# Altium schematic sheet main.SchDoc
size A2
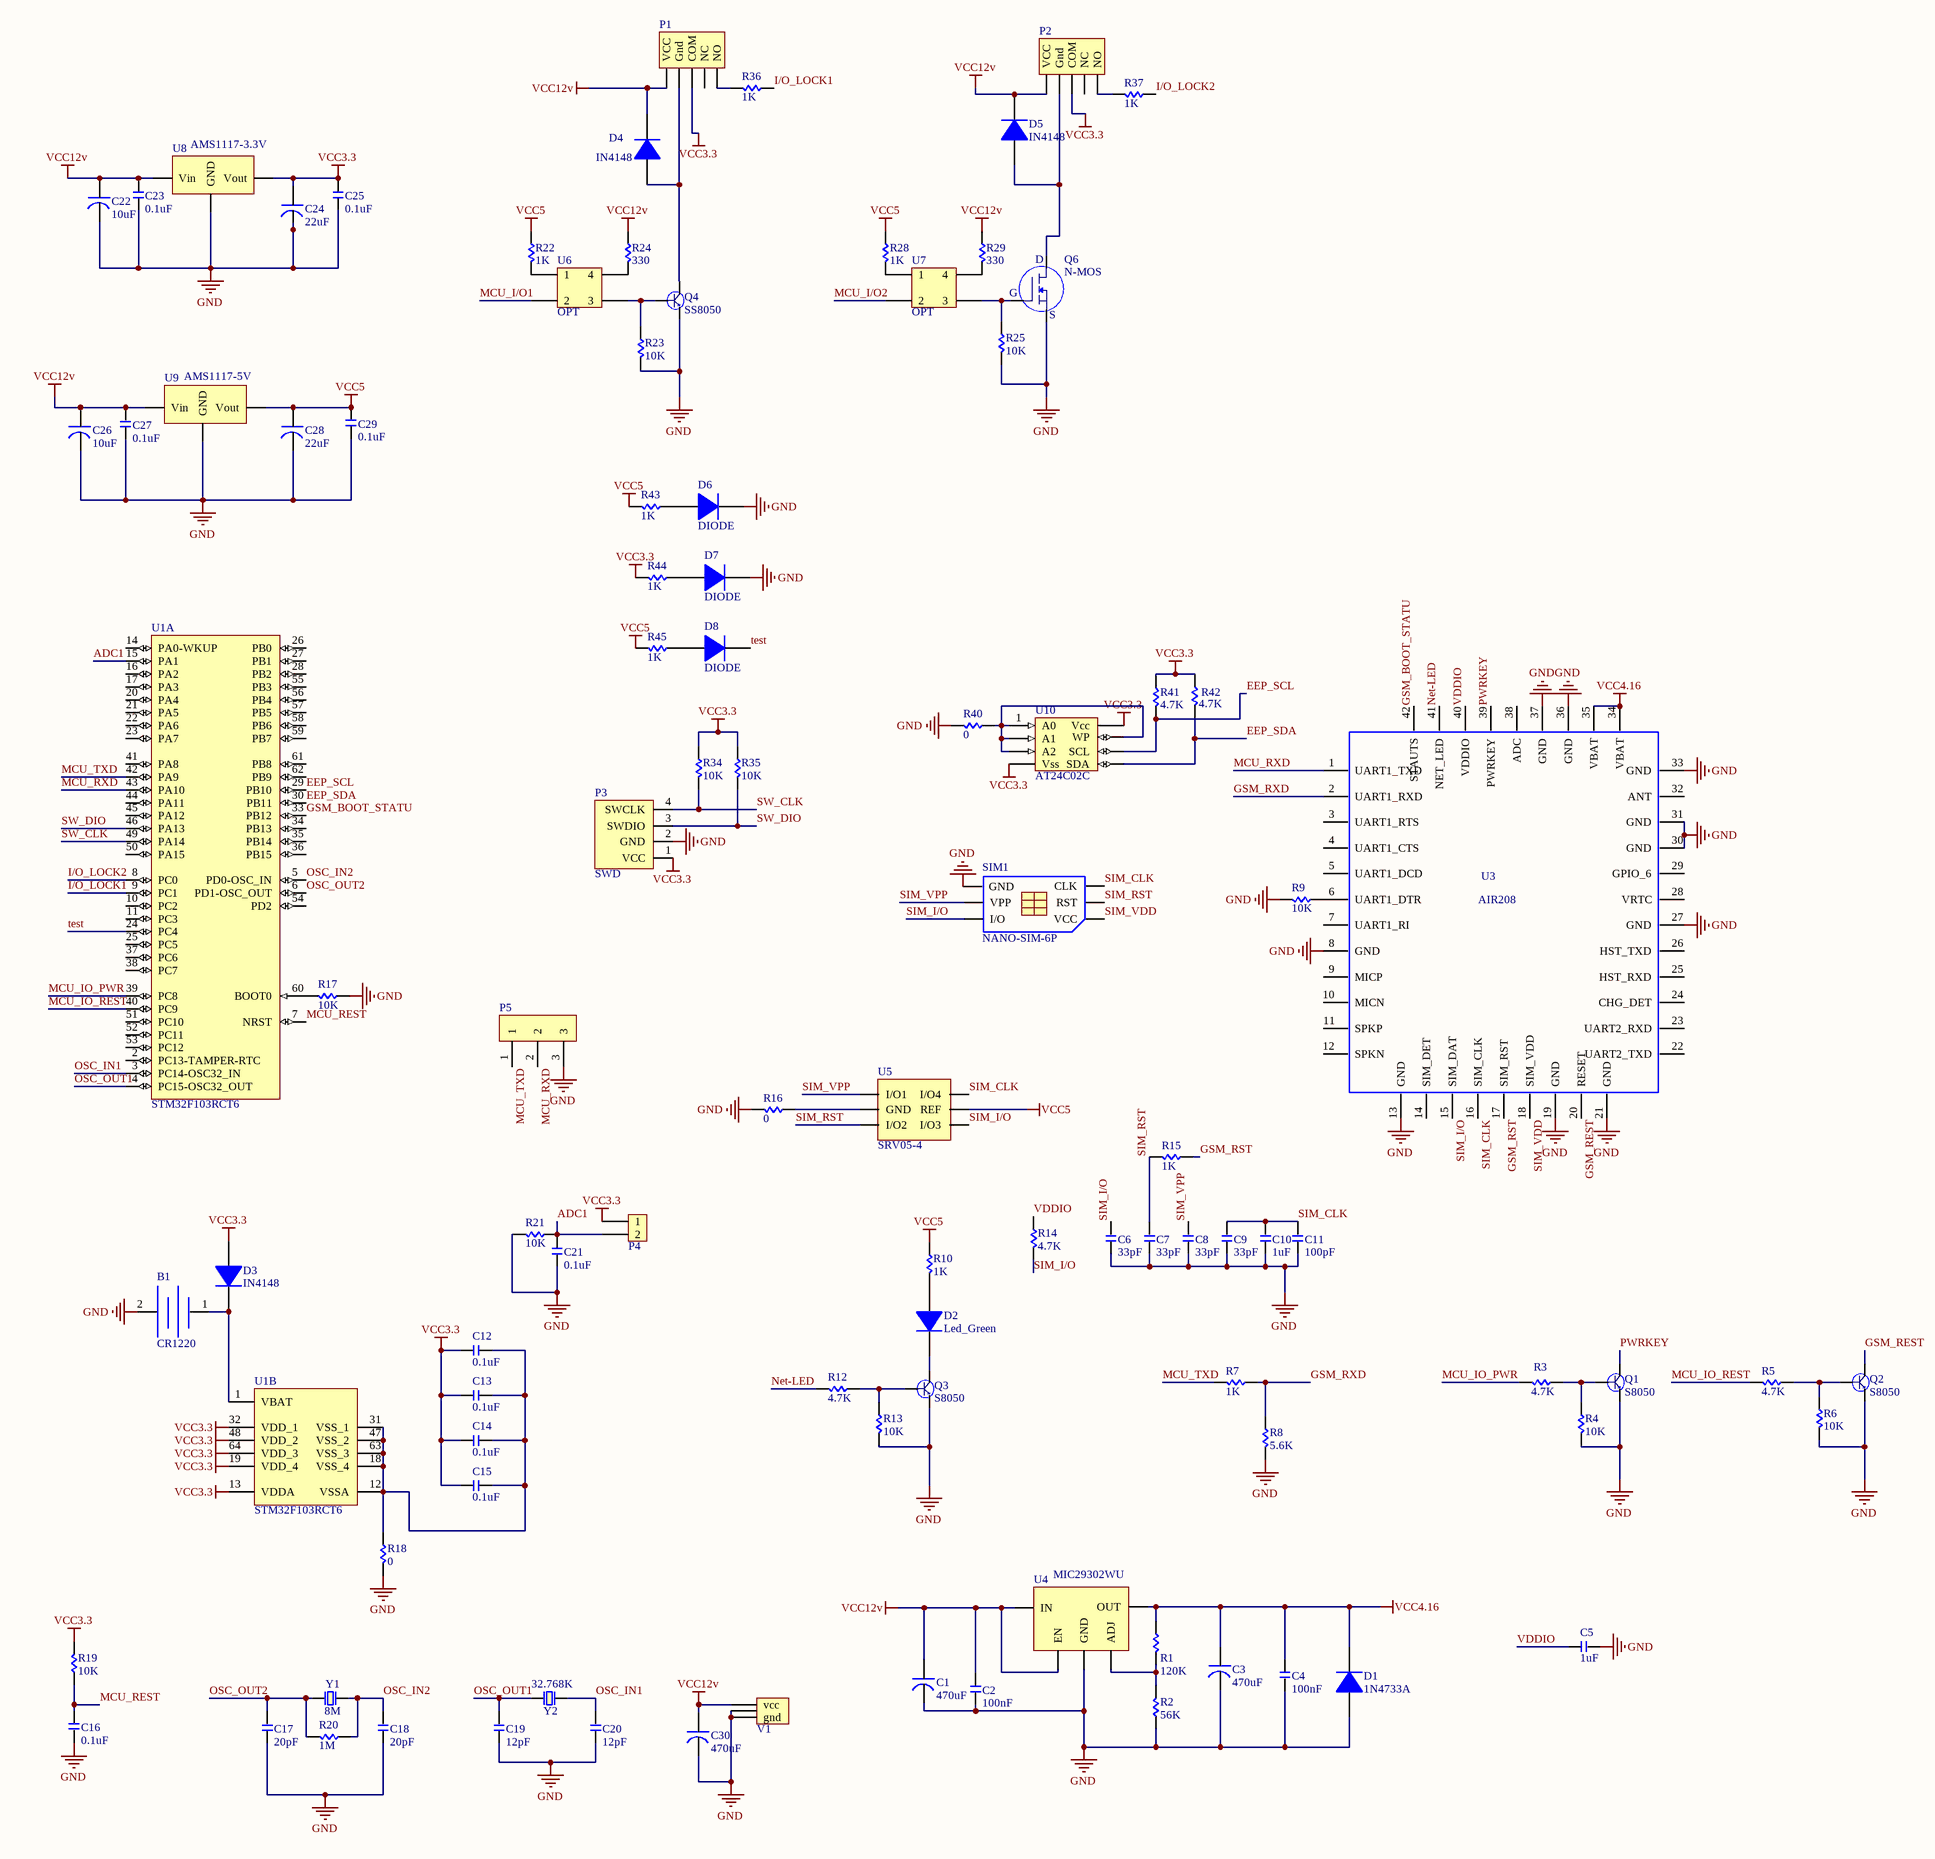
[diagram p0: main.SchDoc]

## Parts
B1  CR1220  [CR1220]
C1  470uF  [10mmx10mm+]
C2  100nF  [0805]
C3  470uF  [10mmx10mm+]
C4  100nF  [0805]
C5  1uF  [0805]
C6  33pF  [0805]
C7  33pF  [0805]
C8  33pF  [0805]
C9  33pF  [0805]
C10  1uF  [0805]
C11  100pF  [0805]
C12  0.1uF  [0805]
C13  0.1uF  [0805]
C14  0.1uF  [0805]
C15  0.1uF  [0805]
C16  0.1uF  [0805]
C17  20pF  [0805]
C18  20pF  [0805]
C19  12pF  [0805]
C20  12pF  [0805]
C21  0.1uF  [0805]
C22  10uF  [1206]
C23  0.1uF  [0805]
C24  22uF  [1206]
C25  0.1uF  [0805]
C26  10uF  [1206]
C27  0.1uF  [0805]
C28  22uF  [1206]
C29  0.1uF  [0805]
C30  470uF  [DIP2_8.3x3.1]
D1  1N4733A  [Dip-6mm]
D2  Led_Green  [0603]
D3  IN4148  [1206]
D4  IN4148  [1206]
D5  IN4148  [1206]
D6  DIODE  [0603]
D7  DIODE  [0603]
D8  DIODE  [0603]
P1  Ele_lock_Pin  [Pin5]  (value not drawn)
P2  Ele_lock_Pin  [Pin5]  (value not drawn)
P3  SWD  [PIN4]
P4  Pin2  [XH2.54_2]  (value not drawn)
P5  pin3  [PIN3]  (value not drawn)
Q1  S8050  [sot-23]
Q2  S8050  [sot-23]
Q3  S8050  [sot-23]
Q4  SS8050  [sot-23]
Q6  N-MOS  [SOT-23-3]
R1  120K  [0805]
R2  56K  [0805]
R3  4.7K  [0805]
R4  10K  [0805]
R5  4.7K  [0805]
R6  10K  [0805]
R7  1K  [0805]
R8  5.6K  [0805]
R9  10K  [0805]
R10  1K  [0805]
R12  4.7K  [0805]
R13  10K  [0805]
R14  4.7K  [0805]
R15  1K  [0805]
R16  0  [0603]
R17  10K  [0805]
R18  0  [0603]
R19  10K  [0805]
R20  1M  [0805]
R21  10K  [0805]
R22  1K  [0805]
R23  10K  [0805]
R24  330  [0805]
R25  10K  [0805]
R28  1K  [0805]
R29  330  [0805]
R34  10K  [0805]
R35  10K  [0805]
R36  1K  [0805]
R37  1K  [0805]
R40  0  [0603]
R41  4.7K  [0603]
R42  4.7K  [0603]
R43  1K  [0603]
R44  1K  [0603]
R45  1K  [0603]
SIM1  NANO-SIM-6P  [NANO-SIM-6P]
U1  STM32F103RCT6  [STM-LQFP64_M]  (parts A,B of 2)
U3  AIR208  [Air208]
U4  MIC29302WU  [TO-263-5]
U5  SRV05-4  [Sot-23-6]
U6  OPT  [SOP4]
U7  OPT  [SOP4]
U8  AMS1117-3.3V  [SOT-223]
U9  AMS1117-5V  [SOT-223]
U10  AT24C02C  [SOP8]
V1  POWER_PIN  [POWER_PIN_PCB]  (value not drawn)
Y1  8M  [crystal]
Y2  32.768K  [PIN1.1]

## Nets
GND: B1.2 C1.2 C2.1 C3.2 C4.2 C5.2 C6.1 C7.1 C8.1 C9.1 C10.1 C11.1 C16.2 C17.1 C18.1 C19.1 C20.1 C21.1 C22.2 C23.1 C24.2 C25.1 C26.2 C27.1 C28.2 C29.2 C30.2 D1.1 D6.2 D7.2 P3.2(GND) P5.3 Q1.2 Q2.2 Q3.2 Q4.2 Q6.2(S) R2.2 R4.1 R6.1 R8.1 R9.1 R13.1 R16.1 R17.2 R18.1 R21.1 R23.1 R25.1 R40.1 SIM1.5(GND) U3.8(GND) U3.13(GND) U3.19(GND) U3.21(GND) U3.27(GND) U3.30(GND) U3.31(GND) U3.33(GND) U3.36(GND) U3.37(GND) U4.3(GND) U8.1(GND) U9.1(GND) V1.2(gnd) V1.3
VCC3.3: C12.1 C13.1 C14.1 C15.1 C24.1 C25.2 D3.1 P1.3(COM) P2.3(COM) P3.1(VCC) P4.1 R19.1 R34.2 R35.2 R41.2 R42.2 R44.1 U1.13(VDDA) U1.19(VDD_4) U1.32(VDD_1) U1.48(VDD_2) U1.64(VDD_3) U8.2(Vout) U10.4(Vss) U10.8(Vcc)
VCC4.16: C3.1 C4.1 D1.2 R1.2 U3.34(VBAT) U3.35(VBAT) U4.4(OUT)
VCC5: C28.1 C29.1 R10.2 R22.2 R28.2 R43.1 R45.1 U5.5(REF) U9.2(Vout)
VCC12v: C1.1 C2.2 C22.1 C23.2 C26.1 C27.2 C30.1 D4.2 D5.2 P1.1(VCC) P2.1(VCC) R24.2 R29.2 U4.1(EN) U4.2(IN) U8.3(Vin) U9.3(Vin) V1.1(vcc)
ADC1: C21.2 P4.2 R21.2 U1.15(PA1)
EEP_SCL: R41.1 U1.29(PB10) U10.6(SCL)
EEP_SDA: R42.1 U1.30(PB11) U10.5(SDA)
GSM_BOOT_STATU: U1.33(PB12) U3.42(STAUTS)
GSM_REST: Q2.3 U3.20(RESET)
GSM_RST: R15.2 U3.17(SIM_RST)
GSM_RXD: R7.2 R8.2 U3.2(UART1_RXD)
I/O_LOCK1: R36.2 U1.9(PC1)
I/O_LOCK2: R37.2 U1.8(PC0)
MCU_I/O1: U6.2
MCU_I/O2: U7.2
MCU_IO_PWR: R3.1 U1.39(PC8)
MCU_IO_REST: R5.1 U1.40(PC9)
MCU_REST: C16.1 R19.2 U1.7(NRST)
MCU_RXD: P5.2 U1.43(PA10) U3.1(UART1_TXD)
MCU_TXD: P5.1 R7.1 U1.42(PA9)
Net-LED: R12.1 U3.41(NET_LED)
OSC_IN1: C20.2 U1.3(PC14-OSC32_IN) Y2.2
OSC_IN2: C18.2 R20.2 U1.5(PD0-OSC_IN) Y1.2
OSC_OUT1: C19.2 U1.4(PC15-OSC32_OUT) Y2.1
OSC_OUT2: C17.2 R20.1 U1.6(PD1-OSC_OUT) Y1.1
PWRKEY: Q1.3 U3.39(PWRKEY)
SIM_CLK: C9.2 C10.2 C11.2 SIM1.3(CLK) U3.16(SIM_CLK) U5.6(I/O4)
SIM_I/O: C6.2 R14.1 SIM1.7(I/O) U3.15(SIM_DAT) U5.4(I/O3)
SIM_RST: C7.2 R15.1 SIM1.2(RST) U5.3(I/O2)
SIM_VDD: SIM1.1(VCC) U3.18(SIM_VDD)
SIM_VPP: C8.2 SIM1.6(VPP) U5.1(I/O1)
SW_CLK: P3.4(SWCLK) R34.1 U1.49(PA14)
SW_DIO: P3.3(SWDIO) R35.1 U1.46(PA13)
test: D8.2 U1.24(PC4)
VDDIO: C5.1 R14.2 U3.40(VDDIO)
NetB1_1: B1.1(VCC) D3.2 U1.1(VBAT)
NetC12_2: C12.2 C13.2 C14.2 C15.2 R18.2 U1.12(VSSA) U1.18(VSS_4) U1.31(VSS_1) U1.47(VSS_2) U1.63(VSS_3)
NetD2_1: D2.1 R10.1
NetD2_2: D2.2 Q3.3
NetD4_1: D4.1 P1.2(Gnd) Q4.3
NetD5_1: D5.1 P2.2(Gnd) Q6.3(D)
NetD6_1: D6.1 R43.2
NetD7_1: D7.1 R44.2
NetD8_1: D8.1 R45.2
NetP1_5: P1.5(NO) R36.1
NetP2_5: P2.5(NO) R37.1
NetQ1_1: Q1.1 R3.2 R4.2
NetQ2_1: Q2.1 R5.2 R6.2
NetQ3_1: Q3.1 R12.2 R13.2
NetQ4_1: Q4.1 R23.2 U6.3
NetQ6_1: Q6.1(G) R25.2 U7.3
NetR1_1: R1.1 R2.1 U4.5(ADJ)
NetR9_2: R9.2 U3.6(UART1_DTR)
NetR16_2: R16.2 U5.2(GND)
NetR17_1: R17.1 U1.60(BOOT0)
NetR22_1: R22.1 U6.1
NetR24_1: R24.1 U6.4
NetR28_1: R28.1 U7.1
NetR29_1: R29.1 U7.4
NetR40_2: R40.2 U10.1(A0) U10.2(A1) U10.3(A2) U10.7(WP)

Not connected (* = marked no-connect by the designer): P1 4(NC); P2 4(NC); U1 2(PC13-TAMPER-RTC) 10(PC2) 11(PC3) 14(PA0-WKUP) 16(PA2) 17(PA3) 20(PA4) 21(PA5) 22(PA6) 23(PA7) 25(PC5) 26(PB0) 27(PB1) 28(PB2) 34(PB13) 35(PB14) 36(PB15) 37(PC6) 38(PC7) 41(PA8) 44(PA11) 45(PA12) 50(PA15) 51(PC10) 52(PC11) 53(PC12) 54(PD2) 55(PB3) 56(PB4) 57(PB5) 58(PB6) 59(PB7) 61(PB8) 62(PB9); U3 3(UART1_RTS) 4(UART1_CTS) 5(UART1_DCD) 7(UART1_RI) 9(MICP) 10(MICN) 11(SPKP) 12(SPKN) 14(SIM_DET) 22(UART2_TXD) 23(UART2_RXD) 24(CHG_DET) 25(HST_RXD) 26(HST_TXD) 28(VRTC) 29(GPIO_6) 32(ANT) 38(ADC)

## Library data of the parts
B1 = BAT
C1 C3 C22 C24 C26 C28 C30 = Cap_Elec
C2 C4-C21 C23 C25 C27 C29 = Cap
D1-D5 = DIODE
Q1-Q4 = Npn-Sot-23
R1-R10 R12-R25 R28 R29 R34-R37 R40-R45 = Res
U1 = STM32F103RCT6: ARM Cortex-M3 32-bit MCU, 256 KB Flash, 48 KB Internal RAM, 51 I/Os, 64-pin LQFP, -40 to 85 degC, Tray; A/D Converter: 3x12-bit (16 Channel); D/A Converter: 2x12-bit (2 Channel); FLASH Size (Prog) (kB): 256; I/Os (High Current): 51; Internal RAM Size (kB): 48; Operating Frequency(F) (Processor speed) (MHz): 72; Supply Voltage(Vcc) min (V): 2; DatasheetVersion: Rev. 8; PackageVersion: Rev. 4, 06/2013; PackageReference: LQFP64; PackageDescription: 64-Pin Low Profile Quad Flat Package, 10 x 10 mm Body, 0.5 mm Pitch; Supplier 1: Digi-Key; Supplier Part Number 1: 497-9033-ND; Supplier 2: Newark; Supplier Part Number 2: 01P4099; Supplier 3: Newark; Supplier Part Number 3: 57P1227; Supplier 4: Mouser; Supplier Part Number 4: 511-STM32F103RCT6; Core: ARM Cortex-M3; Packing: Tray; Mounting Technology: Surface Mount; PartNumber: STM32F103RCT6; ComponentLink1Description: Manufacturer URL; ComponentLink1URL: http://www.st.com/web/en/home.html; ComponentLink2Description: Datasheet; ComponentLink2URL: http://www.st.com/st-web-ui/static/active/en/resource/technical/document/datasheet/CD00191185.pdf; ComponentLink3Description: Package Specification; ComponentLink3URL: http://www.st.com/st-web-ui/static/active/en/resource/technical/document/datasheet/DM00037051.pdf
U3 = AIR208: Geometry.Height: 2.3 mm; PCB DECAL: AIR208
U9 = AMS1117-3.3V
Y1 Y2 = crystal